# EAGLE design PL-N823-01 Analog Breakout (EAGLE 9.4.0)
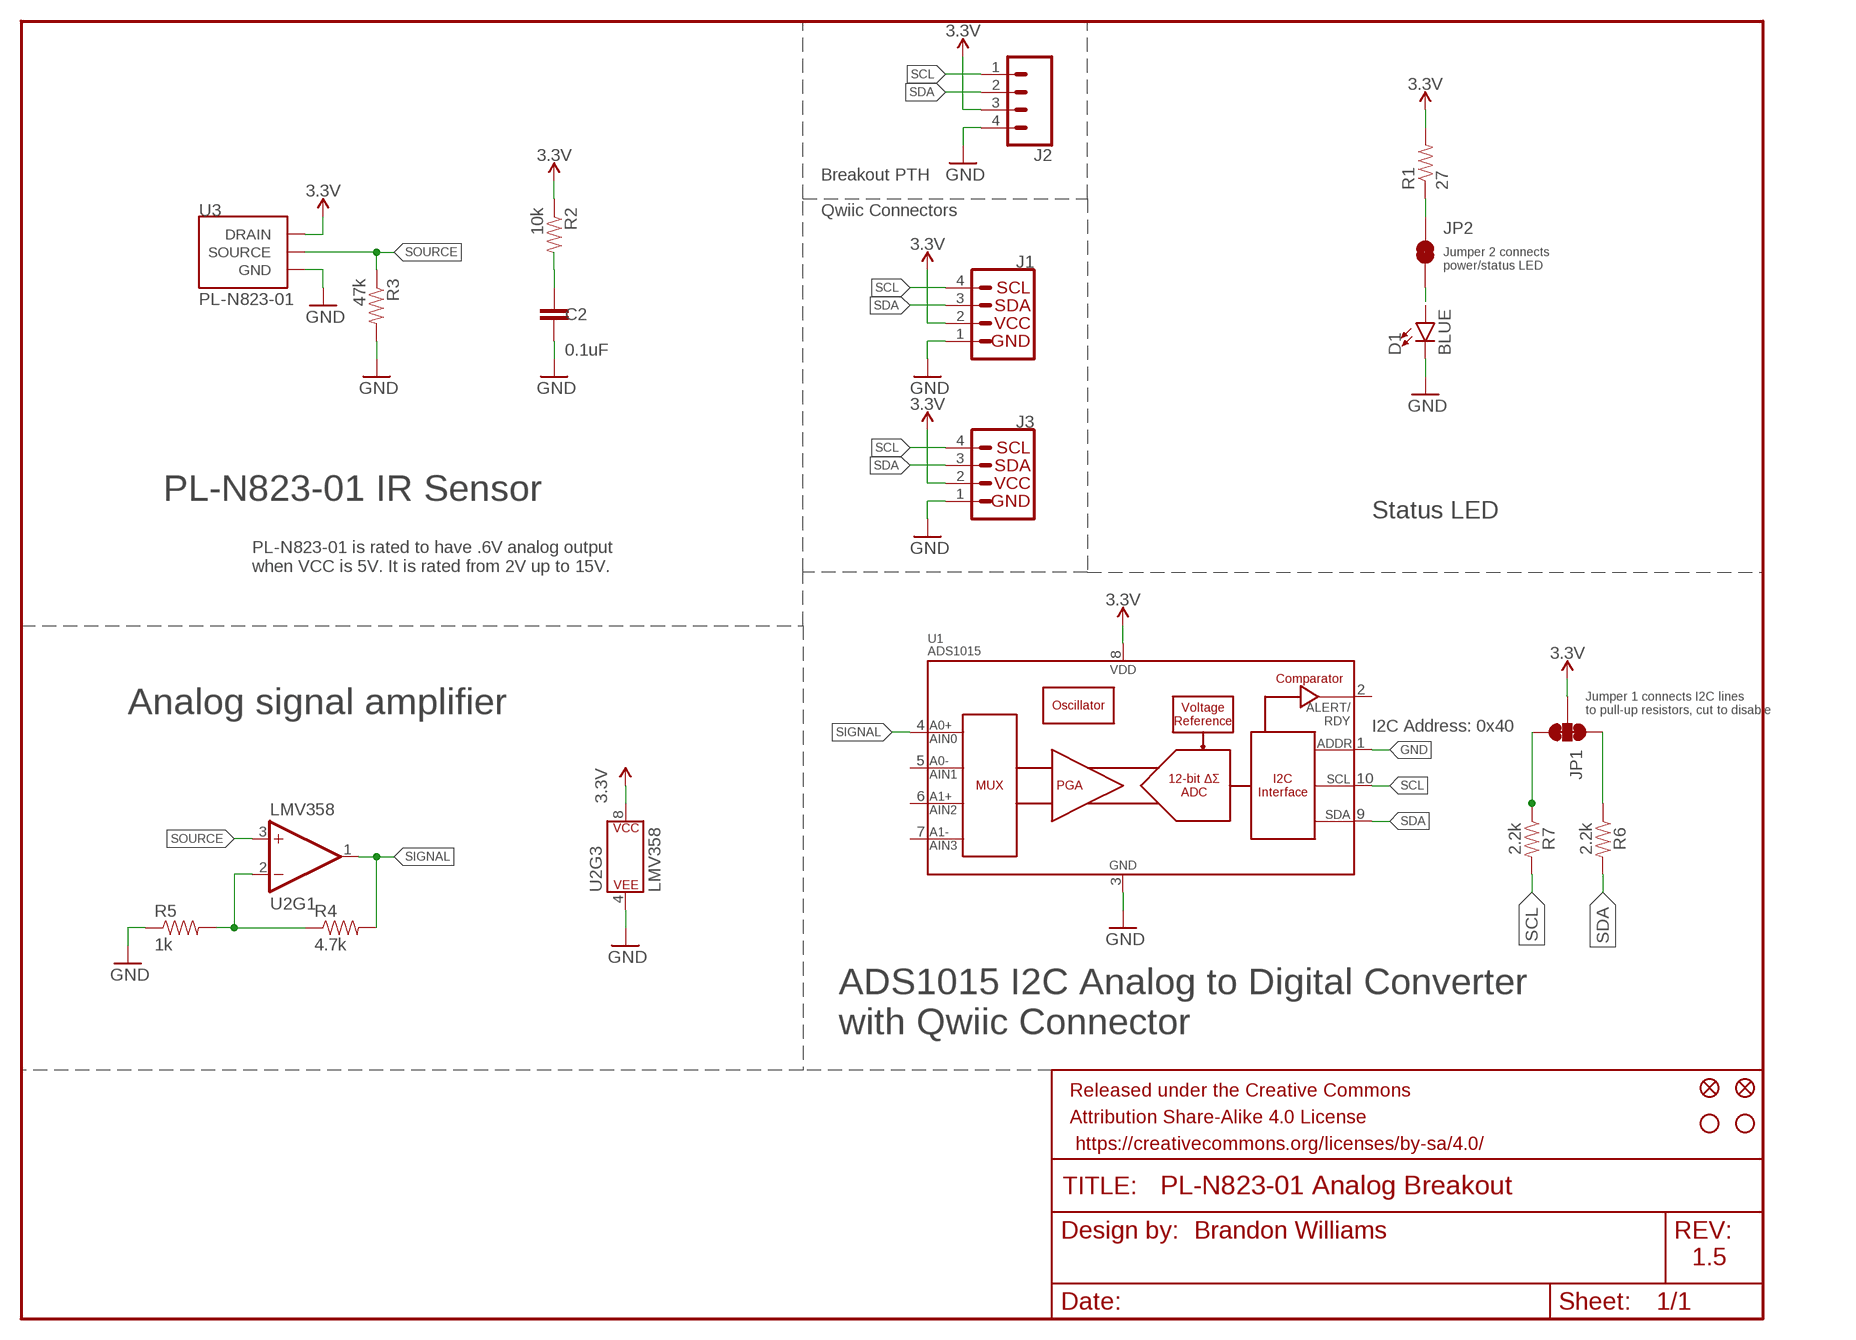
[diagram p0: schematic, sheet 1]

## Parts
C2  0.1uF  0.1UF-0603-25V-(+80/-20%)  [0603]
D1  BLUE  LED-BLUE0603  [LED-0603]
FD1  FIDUCIALUFIDUCIAL  [FIDUCIAL-MICRO]
FD2  FIDUCIALUFIDUCIAL  [FIDUCIAL-MICRO]
FRAME1  FRAME-LETTERNO_PACKAGE  [DUMMY]
H1  STAND-OFFTIGHT  [STAND-OFF-TIGHT]
H2  STAND-OFFTIGHT  [STAND-OFF-TIGHT]
J1  QWIIC_CONNECTORJS-1MM  [1X04_1MM_RA]
J2  CONN_041X04_NO_SILK  [1X04_NO_SILK]
J3  QWIIC_CONNECTORJS-1MM  [1X04_1MM_RA]
JP1  JUMPER-SMT_3_2-NC_TRACE_SILK  [SMT-JUMPER_3_2-NC_TRACE_SILK]
JP2  JUMPER-SMT_2_NC_TRACE_SILK  [SMT-JUMPER_2_NC_TRACE_SILK]
R1  27  27OHM-0603-1/10W-1%  [0603]
R2  10k  10KOHM-0603-1/10W-1%  [0603]
R3  47k  47KOHM-0603-1/10W-1%  [0603]
R4  4.7k  4.7KOHM-0603-1/10W-1%  [0603]
R5  1k  1KOHM-0603-1/10W-1%  [0603]
R6  2.2k  2.2KOHM-0603-1/10W-1%  [0603]
R7  2.2k  2.2KOHM-0603-1/10W-1%  [0603]
U1  ADS1015  [MSOP10]
U2  LMV358  LMV358SOIC  [SO08]
U3  PL-N823-01  [PL-N823-01]

## Nets
GND: C2.2 D1.C J1.1(GND) J2.4 J3.1(GND) R3.2 R5.1 U1.1(ADDR) U1.3(VSS) U2.4(P$V-) U3.GND@1(GND) U3.GND@2(GND)
N$1: R4.1 R5.2 U2.2(-IN)
N$2: C2.1 R2.2
N$3: JP2.1 R1.1
N$4: JP1.3 R7.1
N$5: JP1.1 R6.1
N$6: D1.A JP2.2
SCL: J1.4(SCL) J2.1 J3.4(SCL) R7.2 U1.10(SCL)
SDA: J1.3(SDA) J2.2 J3.3(SDA) R6.2 U1.9(SDA)
SIGNAL: R4.2 U1.4(AIN0) U2.1(OUT)
SOURCE: R3.1 U2.3(+IN) U3.SOURCE
VCC: J1.2(VCC) J2.3 J3.2(VCC) JP1.2 R1.2 R2.1 U1.8(VDD) U2.8(P$V+) U3.DRAIN ; supply symbol labelled 3.3V
Unconnected: U1.2(ALERT/RDY) U1.5(AIN1) U1.6(AIN2) U1.7(AIN3) U2.5(+IN) U2.6(-IN) U2.7(OUT)

## Notes on the sheet
- Breakout PTH
- Qwiic Connectors
- Jumper 2 connects 
  power/status LED
- PL-N823-01 IR Sensor
- Status LED
- PL-N823-01 is rated to have .6V analog output
  when VCC is 5V. It is rated from 2V up to 15V.
- Analog signal amplifier
- Jumper 1 connects I2C lines 
  to pull-up resistors, cut to disable
- I2C Address: 0x40
- ADS1015 I2C Analog to Digital Converter 
  with Qwiic Connector
- Brandon Williams
- 1.5

## Library data of the parts
C2 = SparkFun-Capacitors:0.1UF: 0.1µF ceramic capacitors A capacitor is a passive two-terminal electrical component used to store electrical energy temporarily in an electric field.; PROD_ID: CAP-00810
D1 = SparkFun-LED:LED-BLUE: Blue SMD LED Used in manufacturing of various products at SparkFun Packages: 0603 - SMD 0603 package [Product Link] <http://www.digikey.com/product-detail/en/SMLE12BC7TT86/511-1589-2-ND/1641808> 1206 - SMD1206 package [Product Link] <http://www.digikey.com/product-detail/en/lite-on-inc/LTST-C150TBKT/160-1643-1-ND/573584> SparkFun Products: ESP8266 Thing-Dev Board <https://www.sparkfun.com/products/13711> RedBoard <https://www.sparkfun.com/products/12757>; PROD_ID: DIO-08575
FD1 FD2 = SparkFun-Aesthetics:FIDUCIAL: Fiducial Alignment Points Point-of-reference for pick-and-place machines and other optical instruments.
FRAME1 = SparkFun-Aesthetics:FRAME-LETTER: Schematic Frame - Letter Standard 8.5x11 US Letter frame; DESIGNER: Nobody; VERSION: v01
H1 H2 = SparkFun-Hardware:STAND-OFF: Stand Off Drill holes for mechanically mounting via screws, standoffs, etc. Note: Use the keepout ring to avoid running the screw head into surrounding components. Variant Overviews STAND-OFF - Mechanical footprint for a #4 phillips button head screw. STAND-OFF-TIGHT - Mechanical footprint for a #4 phillips button head screw, Example SparkFun Products Screw - Phillips Head (1/4", 4-40, 10 pack) <https://www.sparkfun.com/products/10453> (PRT-10453) Screw - Phillips Head (1/2", 4-40, 10 pack) <https://www.sparkfun.com/products/10452> (PRT-10452) Screw - Phillips Head (3/4", 4-40, 10 pack) <https://www.sparkfun.com/products/10451> (PRT-10451) Screw - Phillips Head (1", 4-40, 10 pack) <https://www.sparkfun.com/products/10450> (PRT-10450)
J1 J3 = SparkFun-Connectors:QWIIC_CONNECTOR: SparkFun I2C Standard Qwiic Connector An SMD 1mm pitch JST connector makes it easy and quick (get it? Qwiic?) to connect I2C devices to each other. The Qwiic system <http://www.sparkfun.com/qwiic> enables fast and solderless connection between popular platforms and various sensors and actuators. We carry 200mm <https://www.sparkfun.com/products/14204>, 100mm <https://www.sparkfun.com/products/14205>, 50mm <https://www.sparkfun.com/products/14206>, and breadboard friendly <https://www.sparkfun.com/products/14207> Qwiic cables. We also offer 10 pcs strips <https://www.sparkfun.com/products/14323> the SMD connectors.
J2 = SparkFun-Connectors:CONN_04: Multi connection point. Often used as Generic Header-pin footprint for 0.1 inch spaced/style header connections On any of the 0.1 inch spaced packages, you can populate with these: Break Away Headers - Straight <https://www.sparkfun.com/products/116> (PRT-00116) Break Away Male Headers - Right Angle <https://www.sparkfun.com/products/553> (PRT-00553) Female Headers <https://www.sparkfun.com/products/115> (PRT-00115) Break Away Headers - Machine Pin <https://www.sparkfun.com/products/117> (PRT-00117) Break Away Female Headers - Swiss Machine Pin <https://www.sparkfun.com/products/743> (PRT-00743) For SCREWTERMINALS and SPRING TERMINALS visit here: Screw Terimnals on SparkFun.com <https://www.sparkfun.com/search/results?term=Screw+Terminals> (5mm/3.5mm/2.54mm spacing) This device is also useful as a general connection point to wire up your design to another part of your project. Our various solder wires solder well into these plated through hole pads. Hook-Up Wire - Assortment (Stranded, 22 AWG) <https://www.sparkfun.com/products/11375> (PRT-11375) Hook-Up Wire - Assortment (Solid Core, 22 AWG) <https://www.sparkfun.com/products/11367> (PRT-11367) View the entire wire category on our website here <https://www.sparkfun.com/categories/141> Special notes: Molex polarized connector foot print use with SKU : PRT-08231 with associated crimp pins and housings. 1MM SMD Version SKU: PRT-10208; PROD_ID: CONN-09696
JP1 = SparkFun-Jumpers:JUMPER-SMT_3_2-NC_TRACE: Normally closed trace jumper (2 of 2 connections) This jumper has a trace between all three pads so they are normally closed (NC). Use a razor knife to open the connection(s). For best results follow the IPC guidelines for cutting traces: Cutout at least 0.063 mm (0.005 in). Remove all loose material to clean up the cut area. Seal the cut with an approved epoxy. Reapply solder to reclose the connection(s).
JP2 = SparkFun-Jumpers:JUMPER-SMT_2_NC_TRACE: Normally closed trace jumper This jumper has a trace between two pads so it's normally closed (NC). Use a razor knife to open the connection. For best results follow the IPC guidelines for cutting traces: Cutout at least 0.063 mm (0.005 in). Remove all loose material to clean up the cut area. Seal the cut with an approved epoxy. Reapply solder to reclose the connection.
R1 = SparkFun-Resistors:27OHM: 27Ω resistor A resistor is a passive two-terminal electrical component that implements electrical resistance as a circuit element. Resistors act to reduce current flow, and, at the same time, act to lower voltage levels within circuits. - Wikipedia; PROD_ID: RES-09334
R2 = SparkFun-Resistors:10KOHM: 10kΩ resistor A resistor is a passive two-terminal electrical component that implements electrical resistance as a circuit element. Resistors act to reduce current flow, and, at the same time, act to lower voltage levels within circuits. - Wikipedia; PROD_ID: RES-00824
R3 = SparkFun-Resistors:47KOHM: 47kΩ resistor A resistor is a passive two-terminal electrical component that implements electrical resistance as a circuit element. Resistors act to reduce current flow, and, at the same time, act to lower voltage levels within circuits. - Wikipedia; PROD_ID: RES-07871
R4 = SparkFun-Resistors:4.7KOHM: 4.7kΩ resistor A resistor is a passive two-terminal electrical component that implements electrical resistance as a circuit element. Resistors act to reduce current flow, and, at the same time, act to lower voltage levels within circuits. - Wikipedia; PROD_ID: RES-07857
R5 = SparkFun-Resistors:1KOHM: 1kΩ resistor A resistor is a passive two-terminal electrical component that implements electrical resistance as a circuit element. Resistors act to reduce current flow, and, at the same time, act to lower voltage levels within circuits. - Wikipedia; PROD_ID: RES-07856
R6 R7 = SparkFun-Resistors:2.2KOHM: 2.2kΩ resistor A resistor is a passive two-terminal electrical component that implements electrical resistance as a circuit element. Resistors act to reduce current flow, and, at the same time, act to lower voltage levels within circuits. - Wikipedia; PROD_ID: RES-08272
U1 = SparkFun-IC-Conversion:ADS1015: ADS1015 12-BIT ADC 12-Bit Del-Sig ADC Four single-ended inputs or two differential inputs Internal PGA I2C interface 2.0-5.5V SparkFun Products SparkFun Block for Intel Edison - ADC <https://www.sparkfun.com/products/13770> (DEV-13770); PROD_ID: IC-12270
U2 = SparkFun-IC-Amplifiers:LMV358: IC LMV358 DUAL OP AMP Jellybean rail-to-rail output op-amp SparkFun Products SparkFun PicoBoard <https://www.sparkfun.com/products/11888> (WIG-11888) SparkFun Vernier Interface Shield <https://www.sparkfun.com/products/12858> (DEV-12858) SparkFun Blynk Board - ESP8266 <https://www.sparkfun.com/products/13794> (WRL-13794) SparkFun Digital Sandbox <https://www.sparkfun.com/products/12651> (DEV-12651 RoHS); PROD_ID: IC-09657
U3 = PL-N823-01:PL-N823-01: Lensless passive infrared sensor from Kemet Electronics

## Board
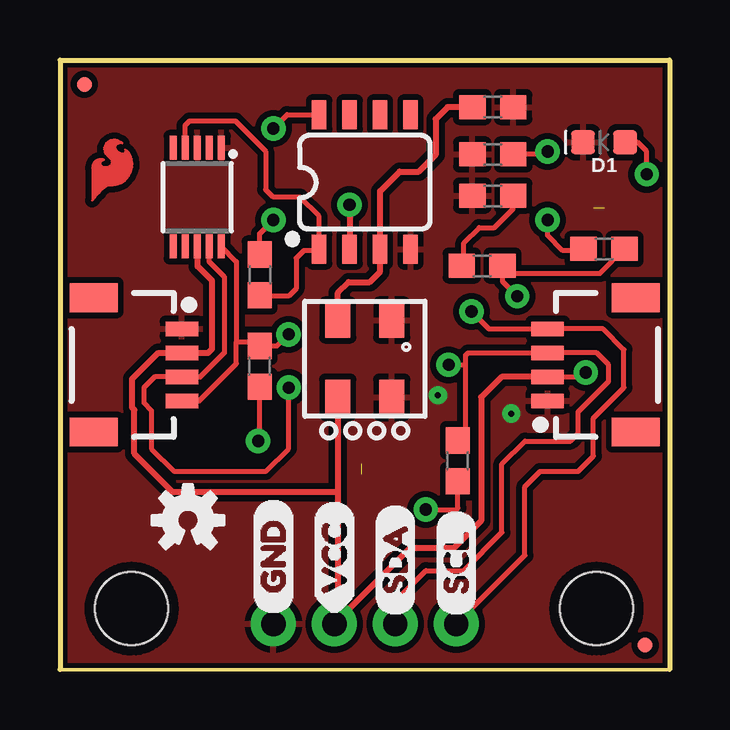
[diagram p1: board, top side]
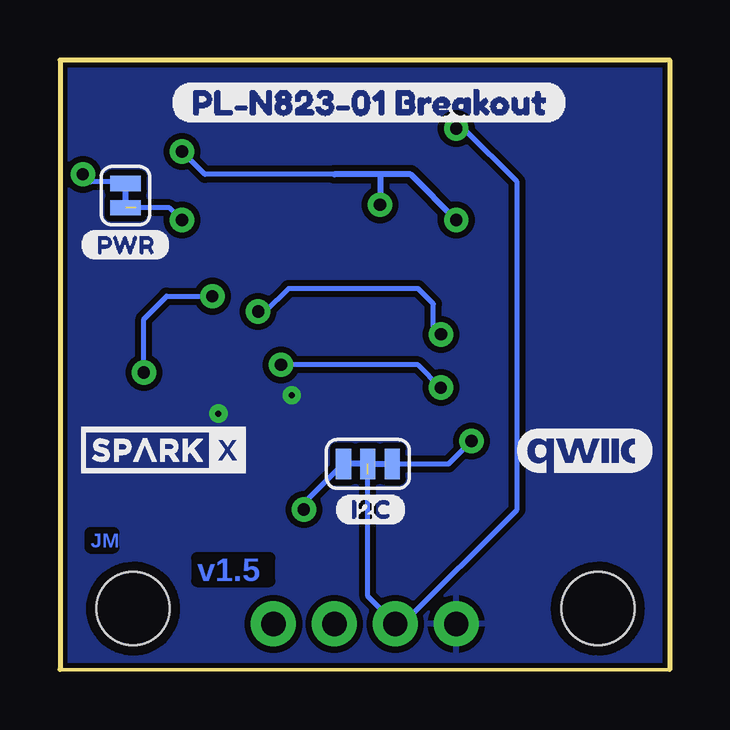
[diagram p2: board, bottom side, seen from below]

Size 25.4 x 25.4 mm. Coordinates in mm from the lower left corner, seen from the top.
Outline: 0,25.4 25.4,25.4 25.4,0 0,0 0,25.4
Copper layers (1*16): Top 0.035mm / dielectric 1.5mm / Bottom 0.035mm
Design rules "SparkFun-2-layer-STANDARD": minimum track width 10mil, minimum drill 20mil, track to track 10mil, track to pad 8mil, pad to pad 8mil, via to via 10mil, smd to smd 8mil, copper to edge 8mil, drill to drill 8mil, minimum pad ring 10mil, minimum via ring 10mil, stop-mask expansion 4mil, vias tented up to drill 25mil, thermal gap 10mil

### Footprints (pad centres in the part's own frame; a part is rotated, then mirrored left to right if it is on the bottom)
0603 = smd 1.1 x 1: 1 -0.85,0; 2 0.85,0
LED-0603 = smd 1 x 1: A -0.877,0; C 0.877,0
FIDUCIAL-MICRO = smd 0.635 x 0.635: 1 0,0
STAND-OFF-TIGHT = hole 3.048: 0,0
1X04_1MM_RA = smd 0.6 x 1.35: 1 -1.5,0; 2 -0.5,0; 3 0.5,0; 4 1.5,0 | smd 1.2 x 2: NC1 2.8,-3.675; NC2 -2.8,-3.675
1X04_NO_SILK = drill 1.016 pad 1.88: 1 0,0; 2 2.54,0; 3 5.08,0; 4 7.62,0
SMT-JUMPER_3_2-NC_TRACE_SILK = smd 0.635 x 1.27: 1 -1.016,0; 2 0,0; 3 1.016,0
SMT-JUMPER_2_NC_TRACE_SILK = smd 0.635 x 1.27: 1 -0.508,0; 2 0.508,0
MSOP10 = smd 0.3 x 1: 1 -1,-2.05; 2 -0.5,-2.05; 3 0,-2.05; 4 0.5,-2.05; 5 1,-2.05; 6 1,2.05; 7 0.5,2.05; 8 0,2.05; 9 -0.5,2.05; 10 -1,2.05
SO08 = smd 0.6 x 1.2: 1 -1.905,-2.8; 2 -0.635,-2.8; 3 0.635,-2.8; 4 1.905,-2.8; 5 1.905,2.8; 6 0.635,2.8; 7 -0.635,2.8; 8 -1.905,2.8
PL-N823-01 = smd 1.05 x 1.475: DRAIN -1.125,-1.613; GND@1 1.125,1.613; GND@2 1.125,-1.613; SOURCE -1.125,1.613

### Placement (x,y rotation side)
C2  18.03,19.75 180 top
D1  22.67,21.97 180 top
FD1  1.02,24.38 0 top
FD2  24.38,1.02 0 top
FRAME1  20.32,3.17 0 top
H1  2.99,2.54 0 top
H2  22.35,2.54 0 top
J1  5.08,12.7 270 top
J2  16.51,1.91 180 top
J3  20.32,12.7 90 top
JP1  12.57,8.57 0 bottom
JP2  22.67,19.75 90 bottom
R1  22.67,17.53 0 top
R2  17.59,16.83 180 top
R3  18.03,23.43 0 top
R4  8.32,16.45 270 top
R5  18.03,21.46 0 top
R6  16.57,8.7 90 top
R7  8.32,12.64 90 top
U1  5.71,19.68 180 top
U2  12.7,20.32 0 top
U3  12.7,12.95 0 top
U$1  [QWIIC_COPYRIGHT_SMALL]  3.56,9.14 0 bottom
U$2  [SFE_LOGO_FLAME_COPPER_EXPOSED_.1]  1.02,19.18 0 top
U$3  [GND0]  8.89,2.29 90 top
U$4  [SCL0]  16.51,2.22 90 top
U$5  [SDA0]  13.97,2.22 90 top
U$6  [VCC0]  11.43,2.29 90 top
U$7  [OSHW-LOGO-S]  5.33,6.22 0 top
U$8  [PL#N823#01_BREAKOUT0]  20.83,23.62 0 bottom
U$9  [PWR-()-03]  24.55,17.7 0 bottom
U$10  [SPARKX-SMALL]  21.08,9.14 0 bottom
U$11  [I2C0]  13.97,6.67 0 bottom

### Tracks (layer width: path | path; a pad name or v marks a point on that pad's centre or on a via)
GND  (via drill 0.25)
  other vias: 15.75,11.43 18.8,10.67
  pour Top: 0,25.4 0,0 25.4,0 25.4,25.4
  pour Bottom: 0,0 0,25.4 25.4,25.4 25.4,0
N$1  (via drill 0.51)
  Top 0.203: R4.1 8.32,18.16 v8.89,18.73 | v20.32,21.59 20.19,21.46 R5.2
  Top 0.254: v12.06,19.37 U2.2
  Bottom 0.203: v20.32,21.59 19.37,20.64 13.97,20.64
  Bottom 0.254: v8.89,18.73 10.79,20.64 12.06,20.64 | 12.06,20.64 13.97,20.64 | 12.06,20.64 v12.06,19.37
N$2
  Top 0.203: R2.2 16.83,16.92 16.83,17.78 17.46,18.41 18.1,18.41 18.88,19.2 C2.1
N$3  (via drill 0.51)  (1 unrouted)
  Top 0.203: R1.1 21.76,17.46 20.95,17.46 20.32,18.1 v20.32,18.73
  Bottom 0.203: 22.24,19.24 20.83,19.24 v20.32,18.73
N$4  (via drill 0.51)
  Top 0.203: v8.26,9.53 8.32,9.59 R7.1
  Bottom 0.203: JP1.3 9.21,8.57 v8.26,9.53
N$5  (via drill 0.51)
  Top 0.203: v15.24,6.67 16.51,6.67 16.57,6.73 R6.1
  Bottom 0.203: JP1.1 15.24,6.92 v15.24,6.67
N$6  (via drill 0.51)
  Top 0.203: v24.45,20.64 24.45,21.59 24.07,21.97 D1.A
  Bottom 0.203: JP2.2 22.73,20.32 24.13,20.32 v24.45,20.64
SCL  (via drill 0.51)
  Top 0.203: J1.4 5.8,11.2 7.35,12.75 7.35,13.65 | U1.10 7.35,17 7.35,13.65 | 7.35,13.65 8.15,13.65 R7.2 9.04,13.49 v9.53,13.97 | J2.1 19.37,4.76 19.37,7.62 20,8.26 21.59,8.26 22.23,8.89 22.23,10.48 23.5,11.75 23.5,13.34 22.63,14.2 J3.4 17.87,14.2 v17.14,14.92
  Bottom 0.203: v9.53,13.97 9.84,14.29 9.84,15.24 10.48,15.88 15.88,15.88 16.83,14.92 v17.14,14.92
SDA  (via drill 0.51)
  Top 0.203: 16.89,12.7 16.89,13.08 17.01,13.2 J3.3 22.36,13.2 22.86,12.7 22.86,12.01 21.59,10.73 21.59,9.84 21.27,9.53 19.37,9.53 18.41,8.57 18.41,5.71 16.83,4.13 15.24,4.13 13.97,2.86 J2.2 | 16.89,12.7 16.89,9.87 R6.2 | U1.9 6.21,17 6.85,16.36 6.85,13.2 5.85,12.2 J1.3 3.94,12.2 3.49,11.75 3.49,11.11 3.81,10.79 3.81,9.21 4.76,8.26 8.57,8.26 9.53,9.21 v9.53,11.75 | v16.19,12.7 16.89,12.7
  Bottom 0.203: v9.53,11.75 10.48,12.7 v16.19,12.7
SIGNAL
  Top 0.2: 10.79,18.89 9.99,19.68 8.89,19.68
  Top 0.203: 10.79,18.89 U2.1 10.74,17.46 10.16,17.46 9.84,17.14 9.84,15.88 9.53,15.56 8.36,15.56 R4.2 | U1.4 5.21,22.68 5.4,22.86 7.3,22.86 8.57,21.59 8.57,20 8.89,19.68
SOURCE
  Top 0.254: U3.SOURCE 11.57,15.7 12.03,16.15 12.9,16.15 13.34,16.59 U2.3 13.34,19.93 14.15,20.75 14.95,20.75 15.65,21.45 15.65,22.93 16.15,23.43 R3.1
VCC  (via drill 0.51)  (1 unrouted)
  Top 0.203: v8.89,22.54 9.47,23.12 U2.8 | R1.2 22.5,16.51 18.76,16.51 R2.1 18.44,16.17 v19.05,15.56 | J3.2 21.73,12.2 v21.91,12.38
  Top 0.254: U1.8 5.73,17.62 5.73,16.8 6.33,16.2 6.33,13.37 6.17,13.2 J1.2 4.1,13.2 3.01,12.11 3.01,10.91 3.1,10.82 3.1,9 4.7,7.4 11.57,7.4 | J3.2 18.4,12.2 17.55,11.35 17.55,6.2 16.4,5.05 14.57,5.05 J2.3 11.57,2.05 11.57,7.4 | U3.DRAIN 11.57,7.4
  Bottom 0.203: 12.57,8.14 12.57,3.05 J2.3 11.11,1.91 6.35,6.67 6.35,20.32 8.57,22.54 v8.89,22.54 | v21.91,12.38 21.91,14.61 20.95,15.56 v19.05,15.56

### Text on the board
Bottom: JM | v1.5